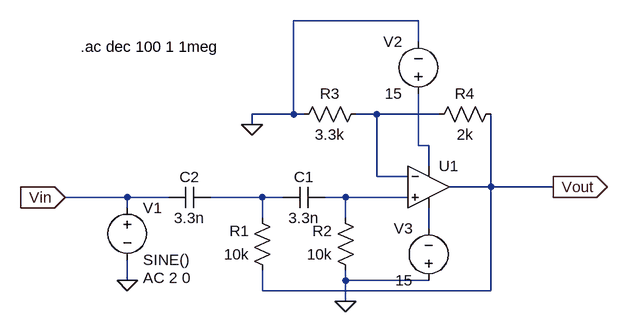
[diagram p0: schematic HP.asc]
HP.asc, the LTspice schematic file:
Version 4
SHEET 1 880 680
WIRE 208 -96 16 -96
WIRE 208 -64 208 -96
WIRE 16 48 16 -96
WIRE 16 48 -48 48
WIRE 32 48 16 48
WIRE 144 48 112 48
WIRE 240 48 144 48
WIRE -48 64 -48 48
WIRE 208 96 208 16
WIRE 224 96 208 96
WIRE 224 128 224 96
WIRE 144 144 144 48
WIRE 192 144 144 144
WIRE 320 160 320 48
WIRE 320 160 256 160
WIRE 416 160 320 160
WIRE -240 176 -336 176
WIRE -176 176 -240 176
WIRE -32 176 -112 176
WIRE 0 176 -32 176
WIRE 96 176 64 176
WIRE 192 176 96 176
WIRE -240 192 -240 176
WIRE -32 208 -32 176
WIRE 96 208 96 176
WIRE 224 224 224 192
WIRE -240 304 -240 272
WIRE 96 304 96 288
WIRE 224 304 96 304
WIRE -32 320 -32 288
WIRE 320 320 320 160
WIRE 320 320 -32 320
WIRE 96 336 96 304
FLAG 96 336 0
FLAG -48 64 0
FLAG -240 304 0
FLAG 416 160 Vout
IOPIN 416 160 Out
FLAG -336 176 Vin
IOPIN -336 176 In
SYMBOL OpAmps\\UniversalOpAmp 224 160 R0
SYMATTR InstName U1
SYMBOL res -16 304 R180
WINDOW 0 36 76 Left 2
WINDOW 3 36 40 Left 2
SYMATTR InstName R1
SYMATTR Value 10k
SYMBOL res 112 304 R180
WINDOW 0 36 76 Left 2
WINDOW 3 36 40 Left 2
SYMATTR InstName R2
SYMATTR Value 10k
SYMBOL cap 64 160 R90
WINDOW 0 0 32 VBottom 2
WINDOW 3 32 32 VTop 2
SYMATTR InstName C1
SYMATTR Value 3.3n
SYMBOL cap -112 160 R90
WINDOW 0 0 32 VBottom 2
WINDOW 3 32 32 VTop 2
SYMATTR InstName C2
SYMATTR Value 3.3n
SYMBOL res 128 32 R90
WINDOW 0 0 56 VBottom 2
WINDOW 3 32 56 VTop 2
SYMATTR InstName R3
SYMATTR Value 3.3k
SYMBOL res 336 32 R90
WINDOW 0 0 56 VBottom 2
WINDOW 3 32 56 VTop 2
SYMATTR InstName R4
SYMATTR Value 2k
SYMBOL voltage -240 176 R0
WINDOW 123 24 124 Left 2
WINDOW 39 0 0 Left 0
SYMATTR InstName V1
SYMATTR Value SINE()
SYMATTR Value2 AC 2 0
SYMBOL voltage 208 32 R180
WINDOW 0 24 96 Left 2
WINDOW 3 24 16 Left 2
WINDOW 123 0 0 Left 0
WINDOW 39 0 0 Left 0
SYMATTR InstName V2
SYMATTR Value 15
SYMBOL voltage 224 320 R180
WINDOW 0 24 96 Left 2
WINDOW 3 24 16 Left 2
WINDOW 123 0 0 Left 0
WINDOW 39 0 0 Left 0
SYMATTR InstName V3
SYMATTR Value 15
TEXT -312 -56 Left 2 !.ac dec 100 1 1meg

The netlist it stands for:
* HP.asc
XU1 N004 N001 N002 N005 Vout level1 Avol=1Meg GBW=10Meg Vos=0 En=0 Enk=0 In=0 Ink=0 Rin=500Meg  ; pins In+ In- V+ V- OUT
R1 Vout N003 10k
R2 0 N004 10k
C1 N004 N003 3.3n
C2 N003 Vin 3.3n
R3 N001 0 3.3k
R4 Vout N001 2k
V1 Vin 0 SINE() AC 2 0
V2 N002 0 15
V3 0 N005 15
.ac dec 100 1 1meg
.lib UniversalOpAmp1.lib
.backanno
.end